# Altium schematic sheet Ref&Supply Unit.SchDoc
size A4
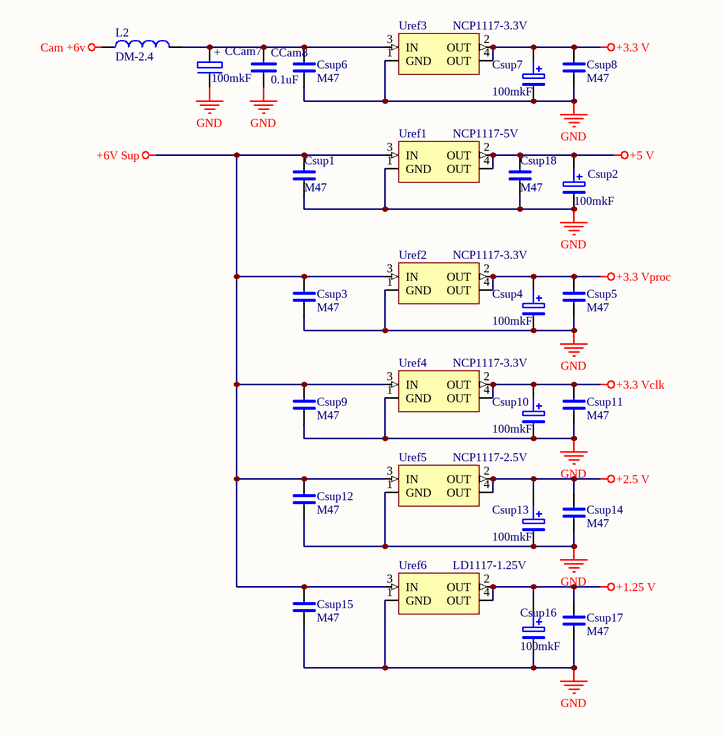
[diagram p0: Ref&Supply Unit.SchDoc]

## Parts
CCam7  100mkF  [CEL-SMD300]
CCam8  0.1uF  [chip0805]
Csup1  M47  [chip0805]
Csup2  100mkF  [CEL-SMD300]
Csup3  M47  [chip0805]
Csup4  100mkF  [CEL-SMD300]
Csup5  M47  [chip0805]
Csup6  M47  [chip0805]
Csup7  100mkF  [CEL-SMD300]
Csup8  M47  [chip0805]
Csup9  M47  [chip0805]
Csup10  100mkF  [CEL-SMD300]
Csup11  M47  [chip0805]
Csup12  M47  [chip0805]
Csup13  100mkF  [CEL-SMD300]
Csup14  M47  [chip0805]
Csup15  M47  [chip0805]
Csup16  100mkF  [CEL-SMD300]
Csup17  M47  [chip0805]
Csup18  M47  [chip0805]
L2  DM-2.4  [DM-2.4]
Uref1  NCP1117-5V  [SOT-223]
Uref2  NCP1117-3.3V  [TO-252]
Uref3  NCP1117-3.3V  [TO-252]
Uref4  NCP1117-3.3V  [TO-252]
Uref5  NCP1117-2.5V  [TO-252]
Uref6  LD1117-1.25V  [TO-252]

## Nets
+1.25 V: Csup16.+ Csup17.1 Uref6.2(OUT) Uref6.4(OUT)
+2.5 V: Csup13.+ Csup14.1 Uref5.2(OUT) Uref5.4(OUT)
+3.3 V: Csup7.+ Csup8.1 Uref3.2(OUT) Uref3.4(OUT)
+3.3 Vclk: Csup10.+ Csup11.1 Uref4.2(OUT) Uref4.4(OUT)
+3.3 Vproc: Csup4.+ Csup5.1 Uref2.2(OUT) Uref2.4(OUT)
+5 V: Csup2.+ Csup18.1 Uref1.2(OUT) Uref1.4(OUT)
+6V Sup: Csup1.1 Csup3.1 Csup9.1 Csup12.1 Csup15.1 Uref1.3(IN) Uref2.3(IN) Uref4.3(IN) Uref5.3(IN) Uref6.3(IN)
Cam +6v: L2.1
GND: CCam7.- CCam8.2 Csup1.2 Csup2.- Csup3.2 Csup4.- Csup5.2 Csup6.2 Csup7.- Csup8.2 Csup9.2 Csup10.- Csup11.2 Csup12.2 Csup13.- Csup14.2 Csup15.2 Csup16.- Csup17.2 Csup18.2 Uref1.1(GND) Uref2.1(GND) Uref3.1(GND) Uref4.1(GND) Uref5.1(GND) Uref6.1(GND)
NetCCam7_+: CCam7.+ CCam8.1 Csup6.1 L2.2 Uref3.3(IN)

## Library data of the parts
CCam7 = C POL
CCam8 = C
Csup1 Csup3 Csup5 Csup6 Csup8 Csup9 Csup11 Csup12 Csup14 Csup15 Csup17 Csup18 = C: Text Field1: 20; Text Field2: 10
Csup2 Csup4 Csup7 Csup10 Csup13 Csup16 = C POL: Text Field1: 20; Text Field2: 20
L2 = INDUCTOR
Uref1 Uref5 Uref6 = NCP1117-3.3V